# Altium schematic sheet SDRAM.SchDoc: foxBMS BMS-Master
size A3; DocumentNumber: 22; SheetNumber: 22; SheetTotal: 24; Author: Fraunhofer IISB foxBMS Team; REL-DATE: 2017-05-16; VERSION: 1.0.2; SheetDescription: 8MB SDRAM
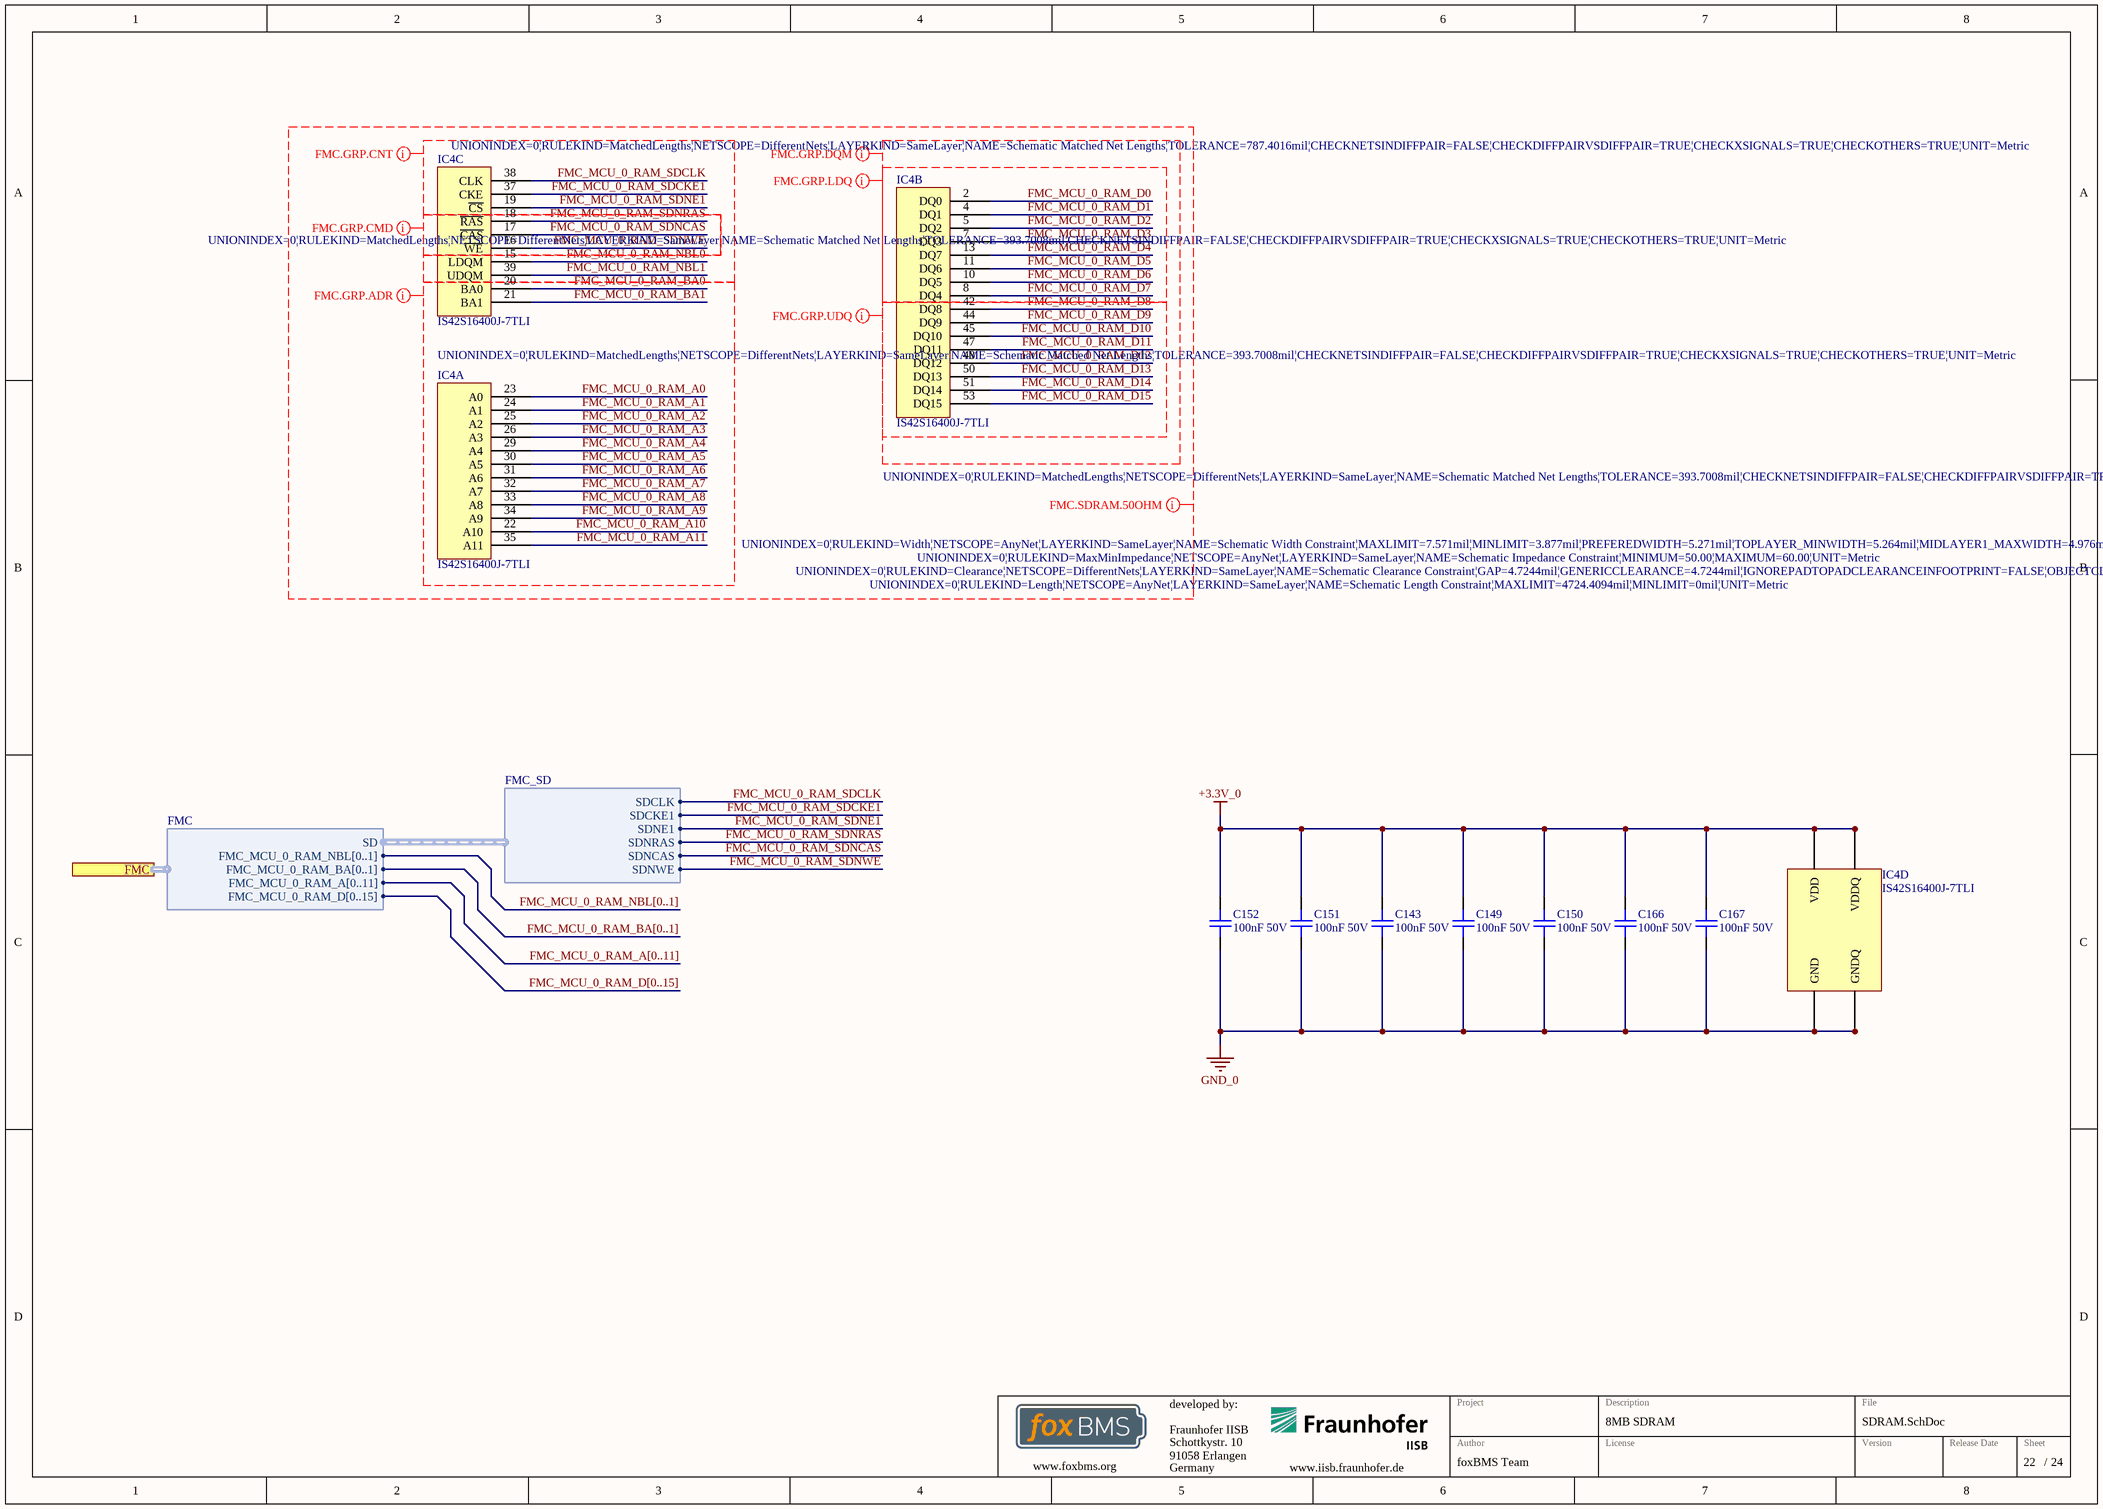
[diagram p0: SDRAM.SchDoc]

## Parts
C143  100nF 50V  [0603C]
C149  100nF 50V  [0603C]
C150  100nF 50V  [0603C]
C151  100nF 50V  [0603C]
C152  100nF 50V  [0603C]
C166  100nF 50V  [0603C]
C167  100nF 50V  [0603C]
IC4  IS42S16400J-7TLI  [TSOP80P1180X120-54N]  (parts A,B,C,D of 4)

## Ports
FMC (harness FMC)

## Harnesses
FMC_SD: SDCLK, SDCKE1, SDNE1, SDNRAS, SDNWE, SDNCAS
FMC: SD, FMC_MCU_0_RAM_NBL[0..1], FMC_MCU_0_RAM_BA[0..1], FMC_MCU_0_RAM_A[0..11], FMC_MCU_0_RAM_D[0..15]

## Nets
+3.3V_0: C143.1 C149.1 C150.1 C151.1 C152.1 C166.1 C167.1 IC4.1(VDD) IC4.3(VDDQ) IC4.9(VDDQ) IC4.14(VDD) IC4.27(VDD) IC4.43(VDDQ) IC4.49(VDDQ)
GND_0: C143.2 C149.2 C150.2 C151.2 C152.2 C166.2 C167.2 IC4.6(GNDQ) IC4.12(GNDQ) IC4.28(GND) IC4.41(GND) IC4.46(GNDQ) IC4.52(GNDQ) IC4.54(GND)
FMC_MCU_0_RAM_A0: IC4.23(A0)
FMC_MCU_0_RAM_A1: IC4.24(A1)
FMC_MCU_0_RAM_A2: IC4.25(A2)
FMC_MCU_0_RAM_A3: IC4.26(A3)
FMC_MCU_0_RAM_A4: IC4.29(A4)
FMC_MCU_0_RAM_A5: IC4.30(A5)
FMC_MCU_0_RAM_A6: IC4.31(A6)
FMC_MCU_0_RAM_A7: IC4.32(A7)
FMC_MCU_0_RAM_A8: IC4.33(A8)
FMC_MCU_0_RAM_A9: IC4.34(A9)
FMC_MCU_0_RAM_A10: IC4.22(A10)
FMC_MCU_0_RAM_A11: IC4.35(A11)
FMC_MCU_0_RAM_BA0: IC4.20(BA0)
FMC_MCU_0_RAM_BA1: IC4.21(BA1)
FMC_MCU_0_RAM_D0: IC4.2(DQ0)
FMC_MCU_0_RAM_D1: IC4.4(DQ1)
FMC_MCU_0_RAM_D2: IC4.5(DQ2)
FMC_MCU_0_RAM_D3: IC4.7(DQ3)
FMC_MCU_0_RAM_D4: IC4.13(DQ7)
FMC_MCU_0_RAM_D5: IC4.11(DQ6)
FMC_MCU_0_RAM_D6: IC4.10(DQ5)
FMC_MCU_0_RAM_D7: IC4.8(DQ4)
FMC_MCU_0_RAM_D8: IC4.42(DQ8)
FMC_MCU_0_RAM_D9: IC4.44(DQ9)
FMC_MCU_0_RAM_D10: IC4.45(DQ10)
FMC_MCU_0_RAM_D11: IC4.47(DQ11)
FMC_MCU_0_RAM_D12: IC4.48(DQ12)
FMC_MCU_0_RAM_D13: IC4.50(DQ13)
FMC_MCU_0_RAM_D14: IC4.51(DQ14)
FMC_MCU_0_RAM_D15: IC4.53(DQ15)
FMC_MCU_0_RAM_NBL0: IC4.15(LDQM)
FMC_MCU_0_RAM_NBL1: IC4.39(UDQM)
FMC_MCU_0_RAM_SDCKE1: IC4.37(CKE) ; harness FMC_SD.SDCKE1
FMC_MCU_0_RAM_SDCLK: IC4.38(CLK) ; harness FMC_SD.SDCLK
FMC_MCU_0_RAM_SDNCAS: IC4.17(~{CAS}) ; harness FMC_SD.SDNCAS
FMC_MCU_0_RAM_SDNE1: IC4.19(~{CS}) ; harness FMC_SD.SDNE1
FMC_MCU_0_RAM_SDNRAS: IC4.18(~{RAS}) ; harness FMC_SD.SDNRAS
FMC_MCU_0_RAM_SDNWE: IC4.16(~{WE}) ; harness FMC_SD.SDNWE

## Buses and harness runs
bus FMC_MCU_0_RAM_A[0..11]
bus FMC_MCU_0_RAM_BA[0..1]
bus FMC_MCU_0_RAM_D[0..15]
bus FMC_MCU_0_RAM_NBL[0..1]

## Layout directives
net class FMC.DQM; rule Matched Net Lengths [Tolerance = 10mm]: FMC_MCU_0_RAM_D0, FMC_MCU_0_RAM_D1, FMC_MCU_0_RAM_D2, FMC_MCU_0_RAM_D3, FMC_MCU_0_RAM_D4, FMC_MCU_0_RAM_D5, FMC_MCU_0_RAM_D6, FMC_MCU_0_RAM_D7, FMC_MCU_0_RAM_D8, FMC_MCU_0_RAM_D9, FMC_MCU_0_RAM_D10, FMC_MCU_0_RAM_D11, FMC_MCU_0_RAM_D12, FMC_MCU_0_RAM_D13, FMC_MCU_0_RAM_D14, FMC_MCU_0_RAM_D15
net class FMC.ADR; rule Matched Net Lengths [Tolerance = 10mm]: FMC_MCU_0_RAM_A0, FMC_MCU_0_RAM_A1, FMC_MCU_0_RAM_A2, FMC_MCU_0_RAM_A3, FMC_MCU_0_RAM_A4, FMC_MCU_0_RAM_A5, FMC_MCU_0_RAM_A6, FMC_MCU_0_RAM_A7, FMC_MCU_0_RAM_A8, FMC_MCU_0_RAM_A9, FMC_MCU_0_RAM_A10, FMC_MCU_0_RAM_A11, FMC_MCU_0_RAM_BA0, FMC_MCU_0_RAM_BA1
net class FMC.CMD; rule Matched Net Lengths [Tolerance = 10mm]: FMC_MCU_0_RAM_SDNCAS, FMC_MCU_0_RAM_SDNRAS, FMC_MCU_0_RAM_SDNWE
net class FMC.CNTRL; rule Matched Net Lengths [Tolerance = 20mm]: FMC_MCU_0_RAM_NBL0, FMC_MCU_0_RAM_NBL1, FMC_MCU_0_RAM_SDCKE1, FMC_MCU_0_RAM_SDCLK, FMC_MCU_0_RAM_SDNE1
net class FMC.LDQ: FMC_MCU_0_RAM_D0, FMC_MCU_0_RAM_D1, FMC_MCU_0_RAM_D2, FMC_MCU_0_RAM_D3, FMC_MCU_0_RAM_D4, FMC_MCU_0_RAM_D5, FMC_MCU_0_RAM_D6, FMC_MCU_0_RAM_D7, FMC_MCU_0_RAM_D8, FMC_MCU_0_RAM_D9, FMC_MCU_0_RAM_D10, FMC_MCU_0_RAM_D11, FMC_MCU_0_RAM_D12, FMC_MCU_0_RAM_D13, FMC_MCU_0_RAM_D14, FMC_MCU_0_RAM_D15
net class FMC.UDQ: FMC_MCU_0_RAM_D0, FMC_MCU_0_RAM_D1, FMC_MCU_0_RAM_D2, FMC_MCU_0_RAM_D3, FMC_MCU_0_RAM_D4, FMC_MCU_0_RAM_D5, FMC_MCU_0_RAM_D6, FMC_MCU_0_RAM_D7, FMC_MCU_0_RAM_D8, FMC_MCU_0_RAM_D9, FMC_MCU_0_RAM_D10, FMC_MCU_0_RAM_D11, FMC_MCU_0_RAM_D12, FMC_MCU_0_RAM_D13, FMC_MCU_0_RAM_D14, FMC_MCU_0_RAM_D15
rule Length Constraint [Min Length = 0mm    Max Length = 120mm]; net class FMC.SDRAM; rule Width Constraint [Pref Impedance = 50.00ohms    Min Impedance = 50.00ohms    Max Impedance = 50.00ohms]; rule Clearance Constraint [Generic clearance = 0.12mm, and 24 value(s) for objects]; rule Impedance Constraint [Min = 50.00    Max = 60.00    ]: FMC_MCU_0_RAM_A0, FMC_MCU_0_RAM_A1, FMC_MCU_0_RAM_A2, FMC_MCU_0_RAM_A3, FMC_MCU_0_RAM_A4, FMC_MCU_0_RAM_A5, FMC_MCU_0_RAM_A6, FMC_MCU_0_RAM_A7, FMC_MCU_0_RAM_A8, FMC_MCU_0_RAM_A9, FMC_MCU_0_RAM_A10, FMC_MCU_0_RAM_A11, FMC_MCU_0_RAM_BA0, FMC_MCU_0_RAM_BA1, FMC_MCU_0_RAM_D0, FMC_MCU_0_RAM_D1, FMC_MCU_0_RAM_D2, FMC_MCU_0_RAM_D3, FMC_MCU_0_RAM_D4, FMC_MCU_0_RAM_D5, FMC_MCU_0_RAM_D6, FMC_MCU_0_RAM_D7, FMC_MCU_0_RAM_D8, FMC_MCU_0_RAM_D9, FMC_MCU_0_RAM_D10, FMC_MCU_0_RAM_D11, FMC_MCU_0_RAM_D12, FMC_MCU_0_RAM_D13, FMC_MCU_0_RAM_D14, FMC_MCU_0_RAM_D15, FMC_MCU_0_RAM_NBL0, FMC_MCU_0_RAM_NBL1, FMC_MCU_0_RAM_SDCKE1, FMC_MCU_0_RAM_SDCLK, FMC_MCU_0_RAM_SDNCAS, FMC_MCU_0_RAM_SDNE1, FMC_MCU_0_RAM_SDNRAS, FMC_MCU_0_RAM_SDNWE

## Notes on the sheet
- Fraunhofer IISB
- Schottkystr. 10
- developed by:
- 91058 Erlangen
- Germany
- Author
- Project
- License
- Description
- File
- Version
- Release Date
- Sheet
- www.foxbms.org
- www.iisb.fraunhofer.de
- foxBMS Team
- /

## Library data of the parts
C143 C149-C152 C166 C167 = gen_C_ceramic_100n_50V_X7R_0603: Ceramic, 100nF, ±10%, 50V, X7R, –55 to 125°C, 0603 (1608),RoHS, Automotive; Part Number: GCJ188R71H104KA12; Manufacturer: Murata; Capacitance: 100n; Case EIA: 0603; Case Metric: 1608; PnP Package: C_0603_10; PnP Value: 100nF/50V/X7R; PnP equipped: x; Automotive Qualified: True; Rated Voltage: 50V; Dielectric: X7R; Supplier 1: Digi-Key; Supplier Part Number 1: 490-5798-1-ND; Height - Seated (Max): 0.8mm; Mounting Type: SurfaceMount,MLCC; Operating Temperature: –55 to 125°C; Series: GCJ; Tolerance: ±10%; Manufacturer_Part_Number: GCJ188R71H104KA12
IC4 = IS42S16400J-7TLI: SDRAM, 4M x 16 Bit; Manufacturer: INTEGRATED SILICON SOLUTION (ISSI); PnP Package: TSOP II; Automotive Qualified: True; Part Number: IS42S16400J-7TLI; Part Name: IS42S16400J-7TLI; Operating Temperature: -40 / o / C to +85 / o / -40°C - +85°C; ComponentLink1Description: Datasheet; ComponentLink1URL: http://www.farnell.com/datasheets/1674895.pdf; Supplier 1: Farnell; Supplier Part Number 1: 2253831